# Altium schematic sheet Top Level.SchDoc
size A4; SheetNumber: 1; SheetTotal: 6
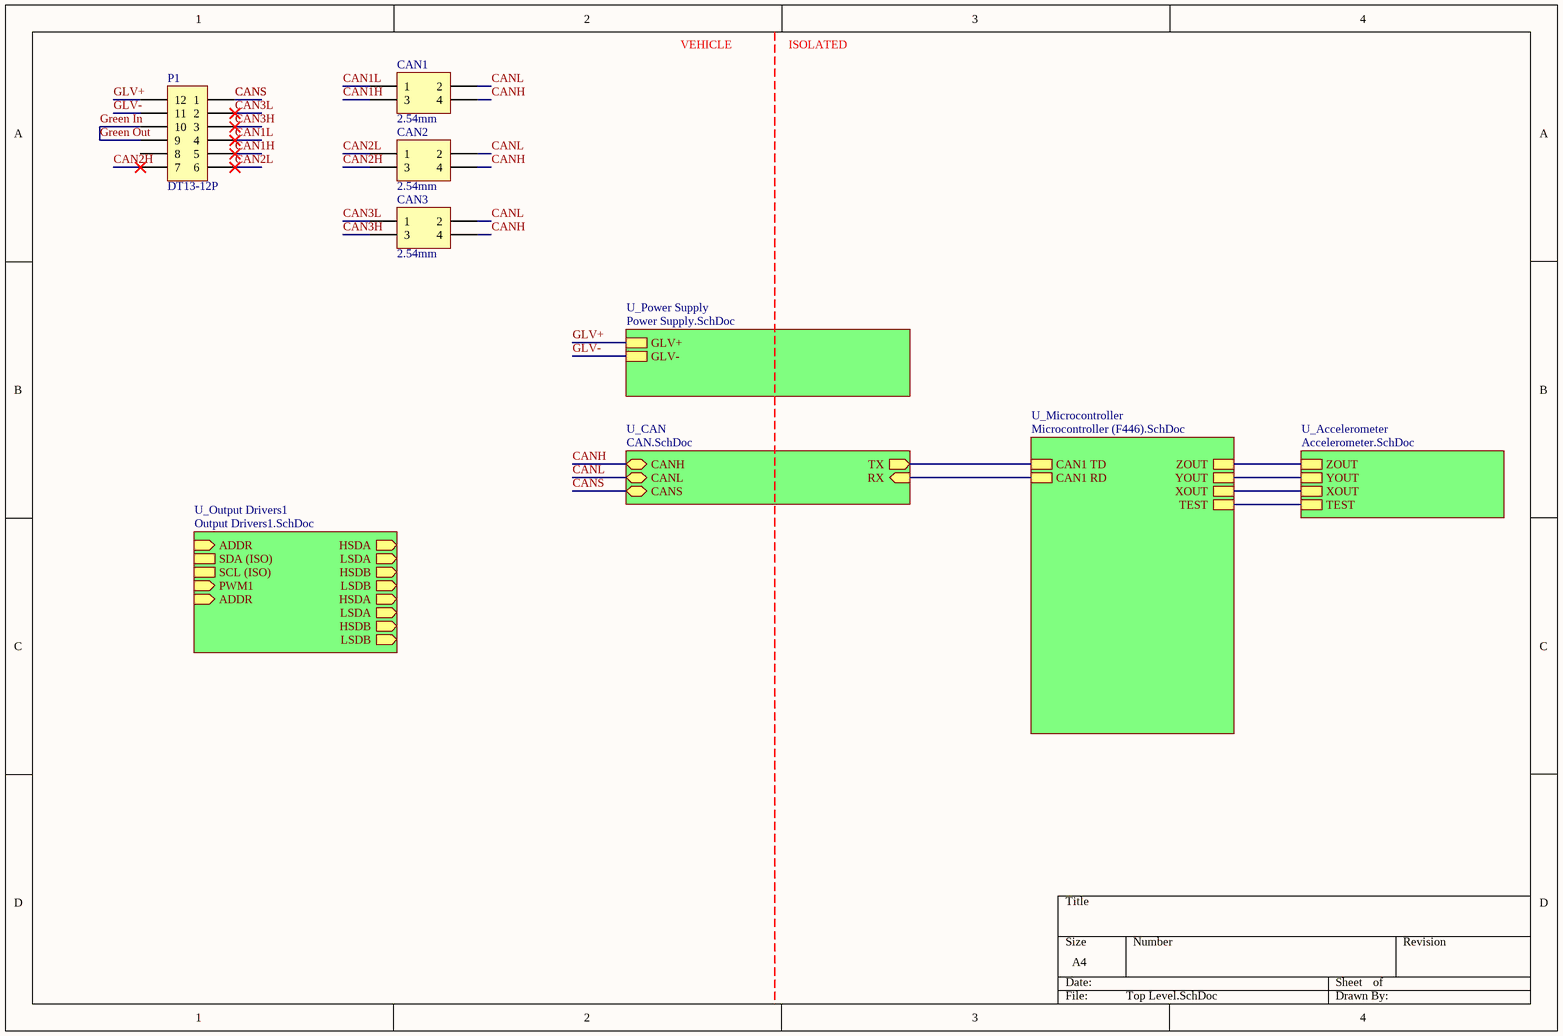
[diagram p0: Top Level.SchDoc]

## Parts
CAN1  2.54mm  [TH 2.54mm Header 2x2]
CAN2  2.54mm  [TH 2.54mm Header 2x2]
CAN3  2.54mm  [TH 2.54mm Header 2x2]
P1  DT13-12P  [DT13-12P]

## Sub-sheets
U_Accelerometer = Accelerometer.SchDoc: ZOUT, XOUT, TEST, YOUT
U_CAN = CAN.SchDoc: CANS (bidir), RX (in), CANL (bidir), CANH (bidir), TX (out)
U_Microcontroller = Microcontroller (F446).SchDoc: CAN1 RD, CAN1 TD, ZOUT, XOUT, YOUT, TEST
U_Output Drivers1 = Output Drivers1.SchDoc: ADDR (in), HSDA (out), LSDA (out), HSDB (out), LSDB (out), SDA (ISO), SCL (ISO), PWM1 (in), HSDA (out), LSDA (out), HSDB (out), LSDB (out), ADDR (in)
U_Power Supply = Power Supply.SchDoc: GLV+, GLV-

## Nets
CAN1H: CAN1.3 P1.5
CAN1L: CAN1.1 P1.4
CAN2H: CAN2.3 P1.7
CAN2L: CAN2.1 P1.6
CAN3H: CAN3.3 P1.3
CAN3L: CAN3.1 P1.2
CANH: CAN1.4 CAN2.4 CAN3.4 ; sheet U_CAN/CANH
CANL: CAN1.2 CAN2.2 CAN3.2 ; sheet U_CAN/CANL
CANS: P1.1 ; sheet U_CAN/CANS
GLV+: P1.12 ; sheet U_Power Supply/GLV+
GLV-: P1.11 ; sheet U_Power Supply/GLV-
Green In: P1.9 P1.10  [also labelled Green Out]
(unnamed): sheet U_CAN/RX, sheet U_Microcontroller/CAN1 RD
(unnamed): sheet U_CAN/TX, sheet U_Microcontroller/CAN1 TD
(unnamed): sheet U_Microcontroller/ZOUT, sheet U_Accelerometer/ZOUT
(unnamed): sheet U_Microcontroller/XOUT, sheet U_Accelerometer/XOUT
(unnamed): sheet U_Microcontroller/YOUT, sheet U_Accelerometer/YOUT
(unnamed): sheet U_Microcontroller/TEST, sheet U_Accelerometer/TEST

Not connected (* = marked no-connect by the designer): P1 8

## Notes on the sheet
- VEHICLE
- ISOLATED

## Library data of the parts
CAN1-CAN3 = TH 2.54mm Header 2x2: Positions: 4; Angle: 0; Flange: No; Contact: NA; Part Number: TH 2.54mm Header 2x2; Pitch: 2.54mm; Row Spacing: 2.54mm
P1 = DT13-12P: Positions: 12; Pitch: 4.44mm; Row Spacing: 6.35mm; Angle: 90; Flange: Yes; Contact: Nickel; Part Number: DT13-12P; Digikey Part Number: 1734-1451-ND; Digikey Link: https://www.digikey.com.au/product-detail/en/te-connectivity-deutsch-connectors/DT13-12PA/1734-1451-ND/7220123